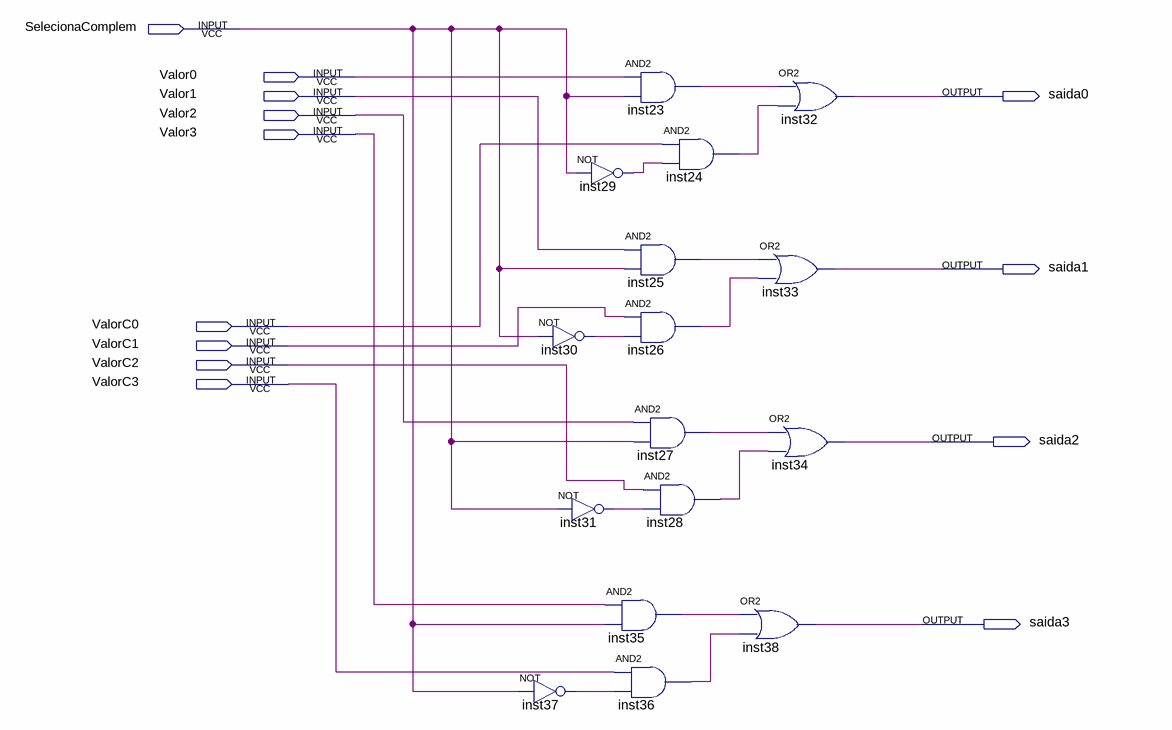
[diagram p0: schematic sheet]
// Quartus schematic MuxSelecionaCompl.bdf as structural Verilog: 16 symbols, 13 pins
module MuxSelecionaCompl (
  input  SelecionaComplem,
  input  Valor0,
  input  Valor1,
  input  Valor2,
  input  Valor3,
  input  ValorC0,
  input  ValorC1,
  input  ValorC2,
  input  ValorC3,
  output saida0,
  output saida1,
  output saida2,
  output saida3
);

  wire inst23_out, inst24_out, inst25_out, inst26_out, inst27_out, inst28_out, inst29_out, inst30_out,
       inst31_out, inst35_out, inst36_out, inst37_out;

  not inst30 (inst30_out, SelecionaComplem);
  not inst37 (inst37_out, SelecionaComplem);
  not inst29 (inst29_out, SelecionaComplem);
  not inst31 (inst31_out, SelecionaComplem);
  and inst35 (inst35_out, Valor3, SelecionaComplem);
  and inst36 (inst36_out, ValorC3, inst37_out);
  and inst23 (inst23_out, Valor0, SelecionaComplem);
  and inst24 (inst24_out, ValorC0, inst29_out);
  and inst25 (inst25_out, Valor1, SelecionaComplem);
  and inst26 (inst26_out, ValorC1, inst30_out);
  and inst27 (inst27_out, Valor2, SelecionaComplem);
  and inst28 (inst28_out, ValorC2, inst31_out);
  or inst33 (saida1, inst25_out, inst26_out);
  or inst34 (saida2, inst27_out, inst28_out);
  or inst38 (saida3, inst35_out, inst36_out);
  or inst32 (saida0, inst23_out, inst24_out);
endmodule
